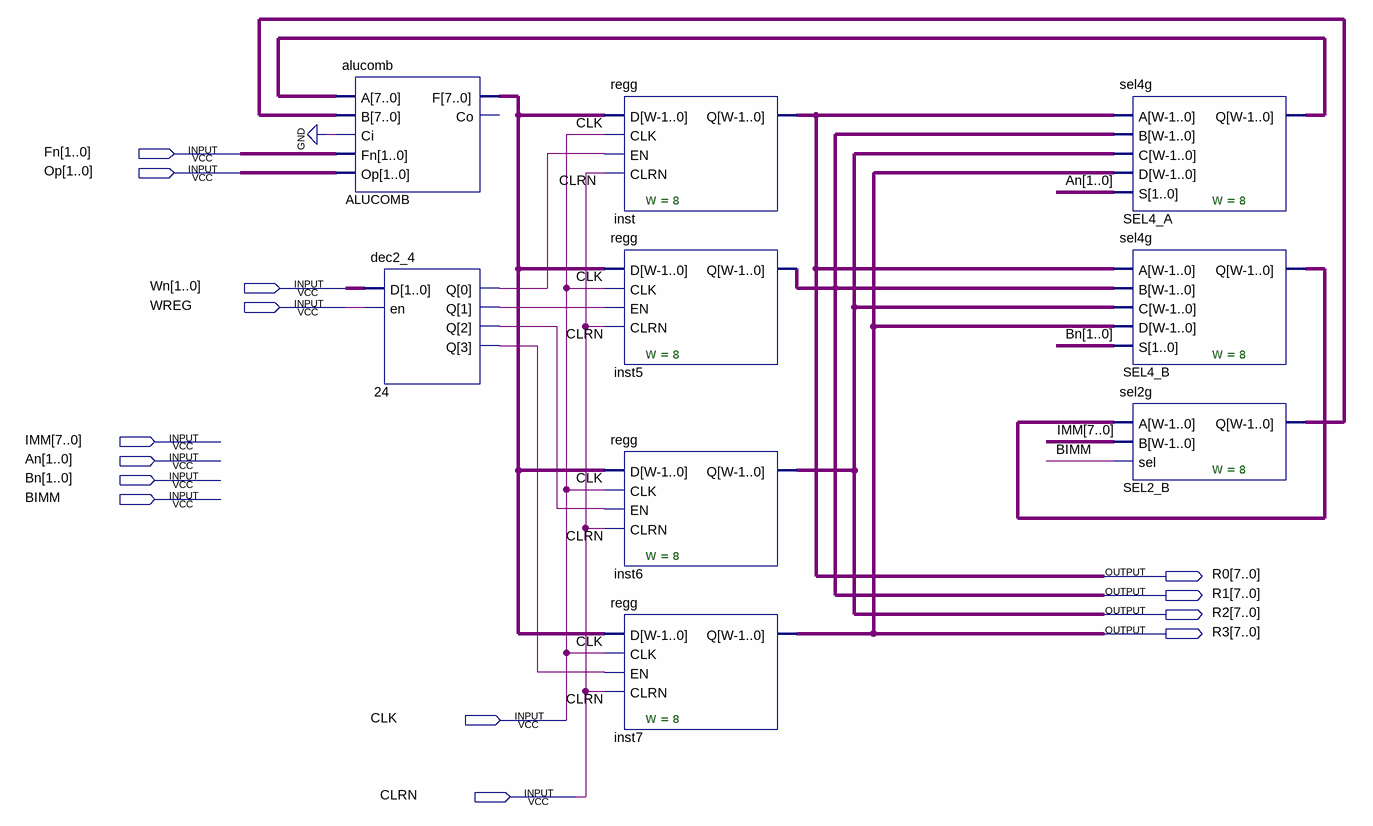
[diagram p0: schematic sheet]
// Quartus schematic alusys.bdf as structural Verilog: 9 symbols, 14 pins
module alusys (
  input  [1:0] Fn,
  input  [1:0] Op,
  input  [1:0] Wn,
  input  WREG,
  input  [7:0] IMM,
  input  [1:0] An,
  input  [1:0] Bn,
  input  BIMM,
  input  CLK,
  input  CLRN,
  output [7:0] R0,
  output [7:0] R1,
  output [7:0] R2,
  output [7:0] R3
);

  wire n24_q, n24_q_2, n24_q_3, n24_q_4;
  wire [7:0] ALUCOMB_f, SEL2_B_q, SEL4_A_q, SEL4_B_q;

  alucomb ALUCOMB (.A(SEL4_A_q), .B(SEL2_B_q), .Ci(1'b0), .Fn(Fn), .Op(Op), .F(ALUCOMB_f));  // open: Co
  dec2_4 u_24 (.D(Wn), .en(WREG), .Q({n24_q_3, n24_q_4, n24_q_2, n24_q}));
  regg #(.W(8)) inst (.D(ALUCOMB_f), .CLK(CLK), .EN(n24_q), .CLRN(CLRN), .Q(R0));
  regg #(.W(8)) inst5 (.D(ALUCOMB_f), .CLK(CLK), .EN(n24_q_2), .CLRN(CLRN), .Q(R1));
  regg #(.W(8)) inst6 (.D(ALUCOMB_f), .CLK(CLK), .EN(n24_q_4), .CLRN(CLRN), .Q(R2));
  regg #(.W(8)) inst7 (.D(ALUCOMB_f), .CLK(CLK), .EN(n24_q_3), .CLRN(CLRN), .Q(R3));
  sel4g #(.W(8)) SEL4_A (.A(R0), .B(R1), .C(R2), .D(R3), .S(An), .Q(SEL4_A_q));
  sel4g #(.W(8)) SEL4_B (.A(R0), .B(R1), .C(R2), .D(R3), .S(Bn), .Q(SEL4_B_q));
  sel2g #(.W(8)) SEL2_B (.A(SEL4_B_q), .B(IMM), .sel(BIMM), .Q(SEL2_B_q));
endmodule
